# Altium schematic sheet LPCB220 - IBEAM INTERFACE.SchDoc
size A3; Address1: Factory 10; Address2: 9-13 Dingley Avenue, Dandeong, VICTORIA 3175, AUSTRALIA; DocumentNumber: 9; Revision: 1; SheetNumber: 9; SheetTotal: 18; Lockie__PCB_SUB_ASSEMBLY: I-Beam Position Interface; Lockie__PCB_ASSEMBLY: Brake Control; Lockie__LDL: LPCB220; Lockie__PCB_DESCRIPTION: Redundant Stepper Node
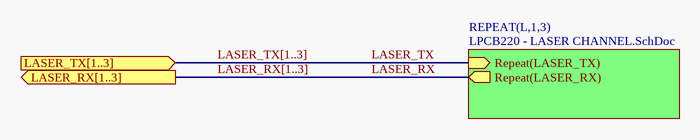
[diagram p0: LPCB220 - IBEAM INTERFACE.SchDoc]

## Sub-sheets
REPEAT(L,1,3) = LPCB220 - LASER CHANNEL.SchDoc: Repeat(LASER_RX) (out), Repeat(LASER_TX) (in)

## Ports
LASER_RX[1..3] (out), LASER_TX[1..3] (in)

## Nets
LASER_RX: sheet REPEAT(L,1,3)/Repeat(LASER_RX)
LASER_TX: sheet REPEAT(L,1,3)/Repeat(LASER_TX)

## Buses and harness runs
bus LASER_RX[1..3] = port LASER_RX[1..3]
bus LASER_TX[1..3] = port LASER_TX[1..3]

## Notes on the sheet
- PCB COMPONENT DESCRIPTION
- LDL NUMBER
- Assembly Details
- Size
- Drawing File Name
- Revision
- http://rloop.org
- Scale
- A3
- Sheet Details
- N.T.S
- Sheet:
- Of: